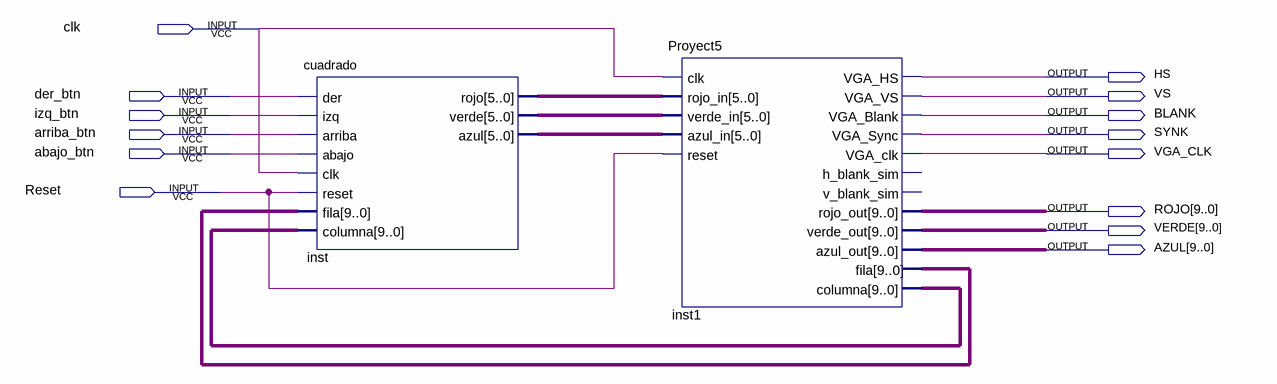
[diagram p0: schematic sheet]
// Quartus schematic c.bdf as structural Verilog: 2 symbols, 14 pins
module c (
  input  clk,
  input  der_btn,
  input  izq_btn,
  input  arriba_btn,
  input  abajo_btn,
  input  Reset,
  output HS,
  output VS,
  output BLANK,
  output SYNK,
  output VGA_CLK,
  output [9:0] ROJO,
  output [9:0] VERDE,
  output [9:0] AZUL
);

  wire [5:0] inst_azul, inst_rojo, inst_verde;
  wire [9:0] inst1_columna, inst1_fila;

  cuadrado inst (
    .der(der_btn), .izq(izq_btn), .arriba(arriba_btn), .abajo(abajo_btn), .clk(clk), .reset(Reset),
    .fila(inst1_fila), .columna(inst1_columna), .rojo(inst_rojo), .verde(inst_verde), .azul(inst_azul));
  Proyect5 inst1 (
    .clk(clk), .rojo_in(inst_rojo), .verde_in(inst_verde), .azul_in(inst_azul), .reset(Reset), .VGA_HS(HS),
    .VGA_VS(VS), .VGA_Blank(BLANK), .VGA_Sync(SYNK), .VGA_clk(VGA_CLK), .rojo_out(ROJO), .verde_out(VERDE),
    .azul_out(AZUL), .fila(inst1_fila), .columna(inst1_columna));  // open: h_blank_sim, v_blank_sim
endmodule
